# EAGLE design Clock (EAGLE 7.1.0)
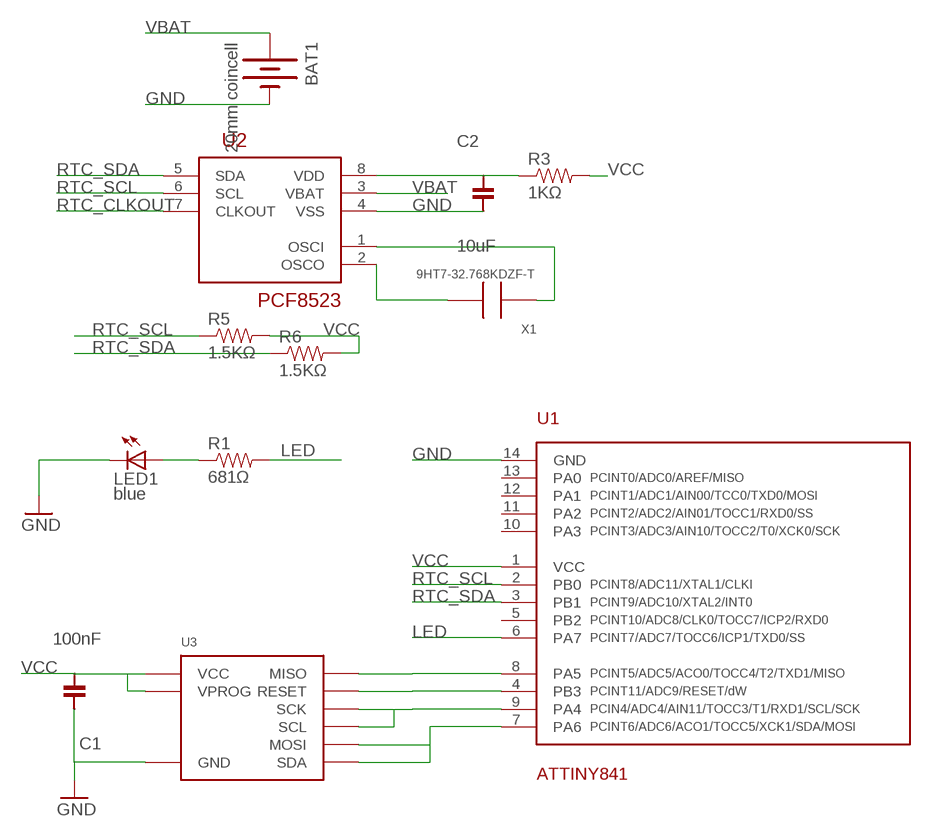
[diagram p0: schematic, sheet 1]

## Parts
BAT1  20mm coincell  BATTERY20MM_4LEGS  [BATTCON_20MM_4LEGS]
C1  100nF  CAPACITOR-100NF  [0603]
C2  10uF  CAPACITOR-10UF  [0603]
LED1  blue  LED-0805-BLUE  [0805-LED]
R1  681Ω  RESISTOR-681Ω  [0603]
R3  1KΩ  RESISTOR-1KΩ  [0603]
R5  1.5KΩ  RESISTOR-1.5KΩ  [0603]
R6  1.5KΩ  RESISTOR-1.5KΩ  [0603]
U1  ATTINY841  [SOIC-14]
U2  PCF8523  [SOIC-8]
U3  EXCLUDE  DEVICE-PCB  [DEVICE-PCB]
X1  9HT7-32.768KDZF-T  CRYSTALABS25  [CRYSTAL-ABS25]

## Nets
GND: BAT1.2(-) C1.1 C2.2 LED1.C U1.14(GND) U2.4(VSS) U3.BUS0(GND)
LED: R1.2 U1.6(PA7)
MISO: U1.8(PA5) U3.PROG3(MISO)
N$3: C2.1 R3.1 U2.8(VDD)
N$4: U2.1(OSCI) X1.P$1
N$5: LED1.A R1.1
N$6: U2.2(OSCO) X1.P$4
RESET: U1.4(PB3) U3.PROG1(RESET)
RTC_CLKOUT: U2.7(CLKOUT)
RTC_SCL: R5.1 U1.2(PB0) U2.6(SCL)
RTC_SDA: R6.1 U1.3(PB1) U2.5(SDA)
SCL/SCK: U1.9(PA4) U3.BUS3(SCL) U3.PROG2(SCK)
SDA/MOSI: U1.7(PA6) U3.BUS1(SDA) U3.PROG4(MOSI)
VBAT: BAT1.1(+) U2.3(VBAT)
VCC: C1.2 R3.2 R5.2 R6.2 U1.1(VCC) U3.BUS2(VCC) U3.PROG0(VPROG)
Unconnected: U1.5(PB2) U1.10(PA3) U1.11(PA2) U1.12(PA1) U1.13(PA0)

## Library data of the parts
BAT1 = SparkFun-Electromechanical:BATTERY: Battery Holders Various common sizes : AA, AAA, 20mm coin cell and 12mm coin cell. 20MM_4LEGS, BATT-10373; PARTNUM: BAT-HLD-001; PROD_ID: BATT-10373
C1 = Modulo:CAPACITOR: Capacitor; PARTNUM: C0603C104K5RACTU
C2 = Modulo:CAPACITOR: Capacitor; PARTNUM: GRM188R60J106ME47D
LED1 = Modulo:LED: LED; PARTNUM: LTST-C171TBKT
R1 = Modulo:RESISTOR: Resistor Basic schematic elements and footprints for 0603, 1206, and PTH resistors.; PARTNUM: ERJ-3EKF6810V
R3 = Modulo:RESISTOR: Resistor Basic schematic elements and footprints for 0603, 1206, and PTH resistors.; PARTNUM: ERJ-3EKF1001V
R5 R6 = Modulo:RESISTOR: Resistor Basic schematic elements and footprints for 0603, 1206, and PTH resistors.; PARTNUM: ERJ-3EKF1501V
U1 = Modulo:ATTINY841; PARTNUM: ATTINY841-SSUR
U2 = IntegerLabs:PCF8523; PARTNUM: PCF8523
U3 = Modulo:DEVICE-PCB: Modulo Footprint
X1 = IntegerLabs:CRYSTAL; PARTNUM: 9HT7-32.768KDZF-T

## Board
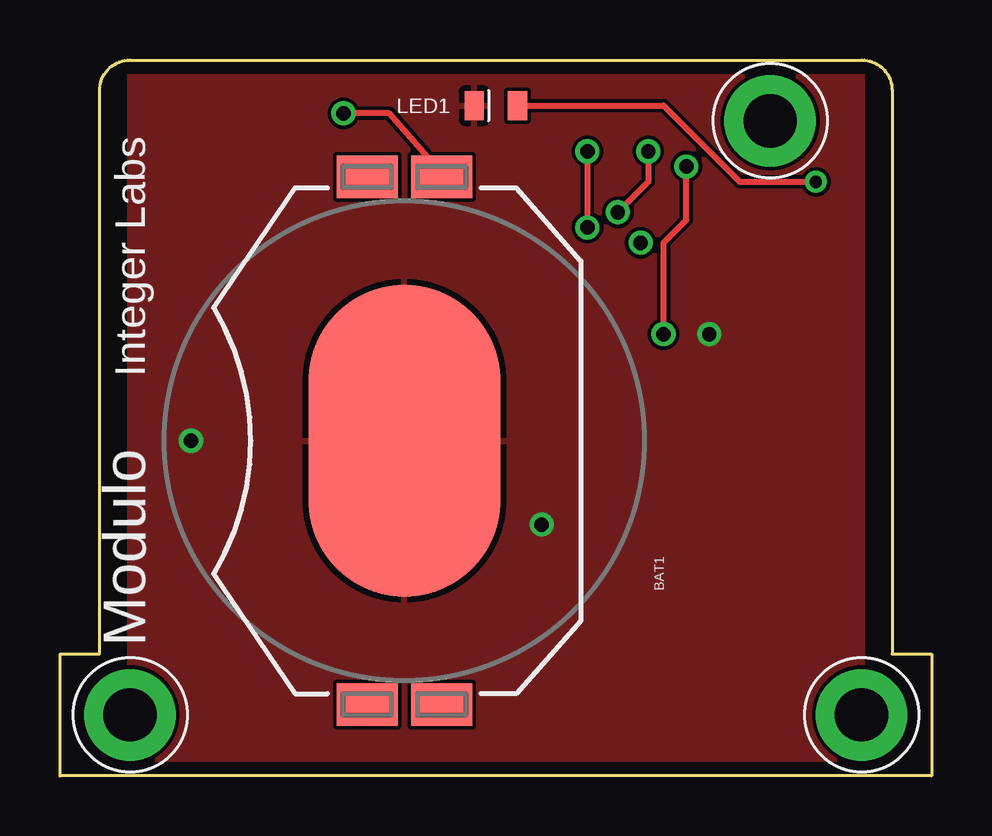
[diagram p1: board, top side]
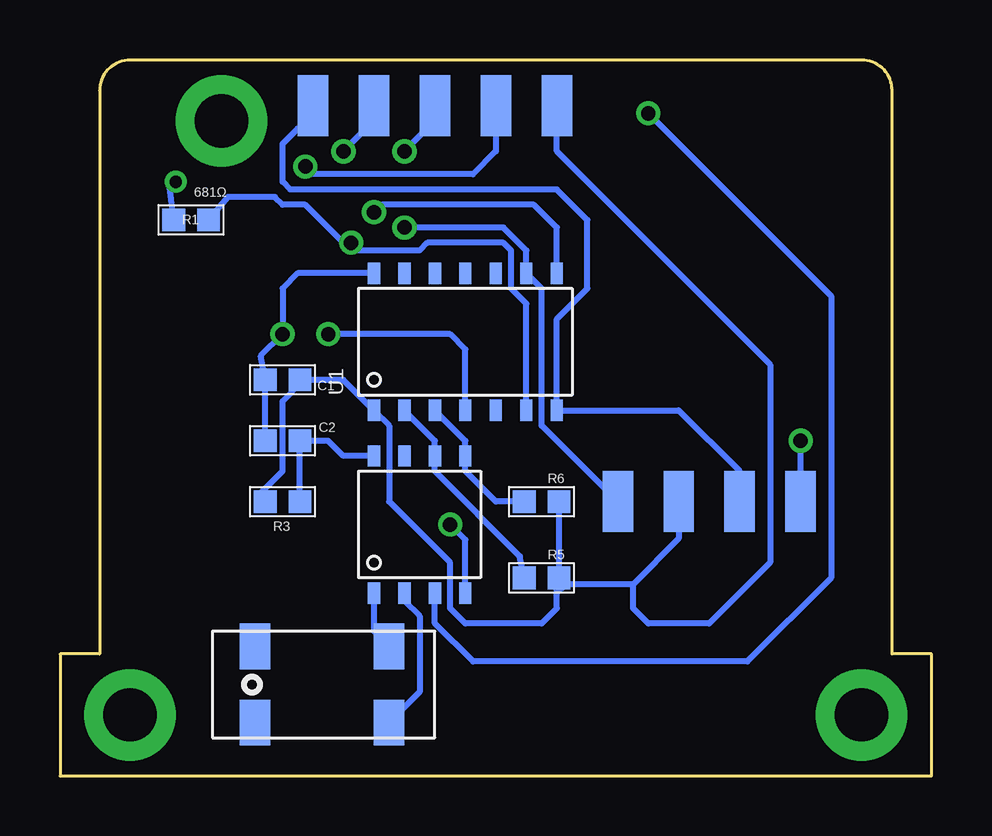
[diagram p2: board, bottom side, seen from below]

Size 36.32 x 29.84 mm. Coordinates in mm from the lower left corner, seen from the top.
Copper layers (1*16): Top 0.0178mm / dielectric 59mil / Bottom 0.0178mm
Design rules "SSC-EAGLE-2Lyr_v1.0.0.3": minimum track width 6mil, minimum drill 14mil, track to track 6mil, track to pad 6mil, pad to pad 6mil, via to via 6mil, smd to smd 6mil, copper to edge 20mil, drill to drill 16mil, minimum pad ring 8mil, minimum via ring 8mil, stop-mask expansion 3mil, vias tented up to drill 0mil, thermal gap 10mil

### Footprints (pad centres in the part's own frame; a part is rotated, then mirrored left to right if it is on the bottom)
BATTCON_20MM_4LEGS = smd 1.778 x 2.54: 1 -11,1.55; 3 11,1.55; P$1 -11,-1.55; P$2 11,-1.55 | smd 13 x 8: 2 0,0
0603 = smd 0.95 x 0.95: 1 -0.725,0; 2 0.725,0
0805-LED = smd 1.2 x 0.8: A 0,-0.9; C 0,0.9
SOIC-14 = smd 0.508 x 0.889: 1 0,-3.175; 2 1.27,-3.175; 3 2.54,-3.175; 4 3.81,-3.175; 5 5.08,-3.175; 6 6.35,-3.175; 7 7.62,-3.175; 8 7.62,2.54; 9 6.35,2.54; 10 5.08,2.54; 11 3.81,2.54; 12 2.54,2.54; 13 1.27,2.54; 14 0,2.54
SOIC-8 = smd 0.508 x 0.889: 1 -1.27,-3.175; 2 0,-3.175; 3 1.27,-3.175; 4 2.54,-3.175; 5 2.54,2.54; 6 1.27,2.54; 7 0,2.54; 8 -1.27,2.54
DEVICE-PCB = smd 1.27 x 2.54 bottom: BUS0 5.08,11.43; BUS1 7.62,11.43; BUS2 10.16,11.43; BUS3 12.7,11.43; PROG0 15.24,27.94; PROG1 17.78,27.94; PROG2 20.32,27.94; PROG3 22.86,27.94; PROG4 25.4,27.94 | drill 2.223 pad 3.81: P$1 2.54,2.54; P$2 33.02,2.54; P$3 29.21,27.305
CRYSTAL-ABS25 = smd 1.27 x 1.905: P$1 0,0; P$2 5.588,0; P$3 5.588,3.175; P$4 0,3.175

### Placement (x,y rotation side)
BAT1  14.35,13.97 270 top
C1  27.05,16.51 0 bottom
C2  27.05,13.97 180 bottom
LED1  18.16,27.94 90 top
R1  30.86,23.18 0 bottom
R3  27.05,11.43 180 bottom
R5  16.26,8.26 0 bottom
R6  16.26,11.43 0 bottom
U1  23.24,18.41 0 bottom
U2  21.97,10.79 0 bottom
U3  0.38,0 0 top
X1  22.61,5.4 180 bottom

### Tracks (layer width: path | path; a pad name or v marks a point on that pad's centre or on a via)
GND  (via drill 0.6)
  Top 0.254: BAT1.2 10.54,13.97
  Bottom 0.254: C2.2 C1.1 27.95,17.52 v27.05,18.41 27.05,20.32 26.42,20.95 U1.14 | U2.4 19.43,9.84 v20.07,10.48 | U3.BUS0 v5.46,13.97
  pour Top: 2.92,30.48 33.4,30.48 33.4,0 2.92,0
LED  (via drill 0.6)
  Bottom 0.254: U1.6 16.89,19.68 17.53,20.32 17.53,21.91 17.84,22.23 21.02,22.23 21.34,21.91 23.88,21.91 v24.19,22.23 24.51,22.23 26.1,23.81 27.05,23.81 27.37,24.13 29.33,24.13 R1.2
MISO  (via drill 0.6)
  Top 0.254: v24.51,26.04 24.51,24.77 v23.24,23.5
  Bottom 0.254: U1.8 15.62,22.86 16.57,23.81 22.92,23.81 v23.24,23.5 | U3.PROG3 23.24,27.3 v24.51,26.04
N$3
  Bottom 0.254: R3.1 C2.1 25.15,13.97 24.51,13.34 U2.8
N$4
  Bottom 0.254: U2.1 23.24,6.03 X1.P$1
N$5  (via drill 0.51)
  Top 0.254: LED1.A 25.15,27.94 28.32,24.77 v31.5,24.77
  Bottom 0.254: R1.1 31.76,24.71 v31.5,24.77
N$6
  Bottom 0.254: U2.2 21.97,7.3 21.34,6.67 21.34,3.49 X1.P$4
RESET  (via drill 0.6)
  Top 0.254: v25.15,18.41 25.15,22.23 26.1,23.18 v26.1,25.4
  Bottom 0.254: U1.4 19.43,17.78 20.07,18.41 v25.15,18.41 | U3.PROG1 18.16,26.04 19.11,25.08 26.1,25.08 v26.1,25.4
RTC_SCL
  Bottom 0.254: U1.2 20.7,13.97 U2.6 20.7,12.7 17.16,9.15 R5.1
RTC_SDA
  Bottom 0.254: R6.1 18.16,11.43 19.43,12.7 U2.5 19.43,13.97 U1.3
SCL/SCK  (via drill 0.6)
  Top 0.254: v21.97,26.04 v21.97,22.86
  Bottom 0.254: U3.BUS3 16.26,14.61 16.26,20.32 U1.9 16.89,21.91 17.84,22.86 v21.97,22.86 | v21.97,26.04 20.7,27.3 U3.PROG2
SDA/MOSI
  Bottom 0.254: U3.BUS1 8,12.7 10.54,15.24 U1.7 15.62,19.05 14.35,20.32 14.35,23.18 15.62,24.45 26.73,24.45 27.05,24.77 27.05,26.35 26.42,26.99 26.1,26.99 25.78,27.3 U3.PROG4
VBAT  (via drill 0.6)
  Top 0.254: BAT1.1 15.9,25.12 13.72,27.62 v11.81,27.62
  Bottom 0.254: v11.81,27.62 4.19,20 4.19,8.26 7.68,4.76 19.11,4.76 20.7,6.35 U2.3
VCC
  Bottom 0.254: R3.2 27.95,11.8 27.05,12.7 27.05,15.61 26.33,16.34 C1.2 24.51,16.51 U1.1 22.61,14.61 22.61,11.43 20.07,8.89 20.07,6.99 19.43,6.35 16.26,6.35 15.62,6.99 15.62,7.62 | R6.2 R5.2 15.62,7.99 15.62,7.62 | 12.45,7.99 12.45,6.99 11.81,6.35 9.27,6.35 6.73,8.89 6.73,17.14 15.62,26.04 U3.PROG0 | U3.BUS2 10.54,9.89 12.45,7.99 | 12.45,7.99 15.25,7.99 15.62,7.62